# Altium schematic sheet Sheet2.SchDoc
size A4
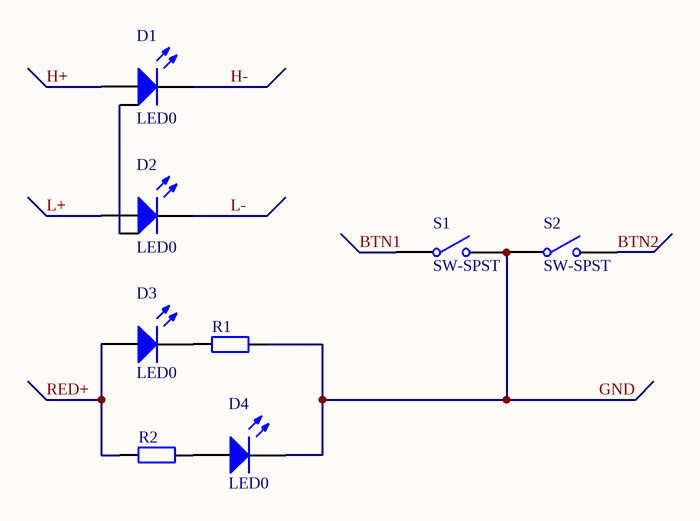
[diagram p0: Sheet2.SchDoc]

## Parts
D1  LED0  [PCBComponent_1]
D2  LED0  [PCBComponent_1]
D3  LED0  [LED 5mm]
D4  LED0  [LED 5mm]
R1  R_SMD_0805  [0805]  (value not drawn)
R2  R_SMD_0805  [0805]  (value not drawn)
S1  SW-SPST  [SPST-2]
S2  SW-SPST  [SPST-2]

## Nets
BTN1: S1.1(COMMON)
BTN2: S2.2(NO)
GND: D4.2(K) R1.1 S1.2(NO) S2.1(COMMON)
H+: D1.1(A)
H-: D1.2(K)
L+: D2.1(A)
L-: D2.2(K)
RED+: D3.1(A) R2.2
NetD1_0: D1.0 D2.0
NetD3_2: D3.2(K) R1.2
NetD4_1: D4.1(A) R2.1

## Library data of the parts
D1-D4 = LED0: Typical INFRARED GaAs LED; Published: 8-Jun-2000; LatestRevisionDate: 08-Jul-2005; LatestRevisionNote: Mech Layer 1 removed.; PackageReference: LED-0; Publisher: Altium Limited
R1 R2 = R_SMD_0805: Резистор; Допуск: +-5%; Корпус: 0805
S1 S2 = SW-SPST: Single-Pole, Single-Throw Switch; Published: 24-Mar-1999; LatestRevisionDate: 17-Jul-2002; LatestRevisionNote: Re-released for DXP Platform.; PackageReference: SPST-2; Publisher: Altium Limited; PackageDescription: Switch; 2 Leads